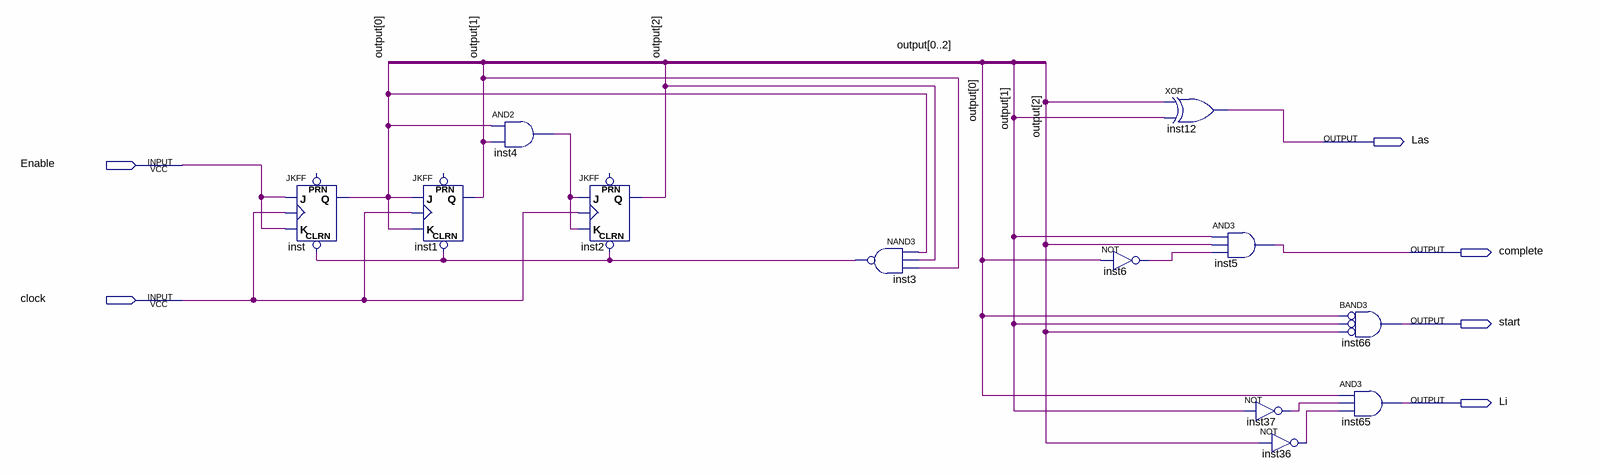
[diagram p0: schematic sheet]
// Quartus schematic state_machine.bdf as structural Verilog: 12 symbols, 6 pins
module state_machine (
  input  Enable,
  input  clock,
  output Las,
  output complete,
  output start,
  output Li
);

  wire inst3_out, inst4_out, inst6_out, inst36_out, inst37_out;
  wire [2:0] \output ;

  JKFF inst (.CLRN(inst3_out), .K(Enable), .J(Enable), .CLK(clock), .Q(\output [0]));  // open: PRN
  JKFF inst1 (.CLRN(inst3_out), .K(\output [0]), .J(\output [0]), .CLK(clock), .Q(\output [1]));  // open: PRN
  and inst4 (inst4_out, \output [0], \output [1]);
  JKFF inst2 (.CLRN(inst3_out), .K(inst4_out), .J(inst4_out), .CLK(clock), .Q(\output [2]));  // open: PRN
  nand inst3 (inst3_out, \output [0], \output [2], \output [1]);
  not inst6 (inst6_out, \output [0]);
  xor inst12 (Las, \output [2], \output [1]);
  and inst5 (complete, \output [1], \output [2], inst6_out);
  not inst37 (inst37_out, \output [1]);
  not inst36 (inst36_out, \output [2]);
  and inst66 (start, ~\output [0], ~\output [1], ~\output [2]);  // BAND3
  and inst65 (Li, \output [0], inst37_out, inst36_out);
endmodule
